# EAGLE schematic variable_supply_module_v2 (EAGLE 6.5.0)
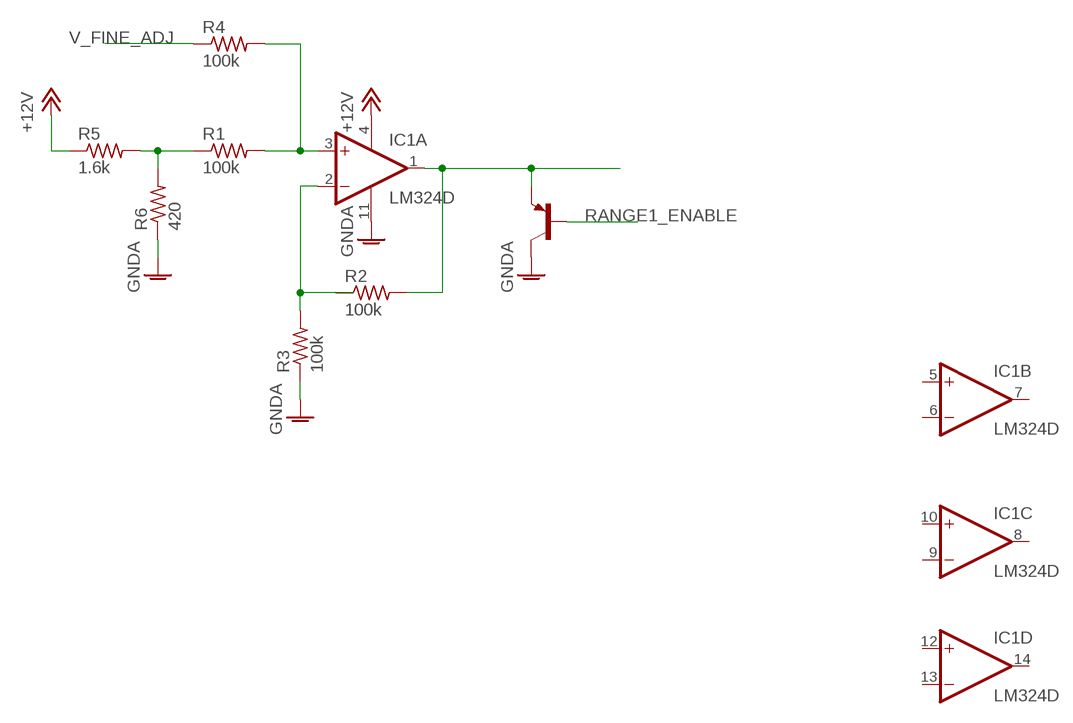
[diagram p0: schematic, sheet 1]

## Parts
IC1  LM324D  [SO14]
R1  100k  R-US_M0805  [M0805]
R2  100k  R-US_M0805  [M0805]
R3  100k  R-US_M0805  [M0805]
R4  100k  R-US_M0805  [M0805]
R5  1.6k  R-US_M0805  [M0805]
R6  420  R-US_M0805  [M0805]
T1  MMBT3906LT1-PNP-SOT23-BEC  [SOT23-BEC]

## Nets
+12V: IC1.4(P:V+) R5.1
GNDA: IC1.11(P:V-) R3.1 R6.1 T1.C
N$1: IC1.1(A:OUT) R2.2 T1.E
N$2: IC1.2(A:-IN) R3.2
N$3: IC1.3(A:+IN) R1.2 R4.2
N$4: R1.1 R5.2 R6.2
RANGE1_ENABLE: T1.B
V_FINE_ADJ: R4.1
Unconnected: IC1.5(B:+IN) IC1.6(B:-IN) IC1.7(B:OUT) IC1.8(C:OUT) IC1.9(C:-IN) IC1.10(C:+IN) IC1.12(D:+IN) IC1.13(D:-IN) IC1.14(D:OUT) R2.1

## Library data of the parts
IC1 = linear:LM324: OP AMP
R1-R6 = resistor:R-US_: RESISTOR, American symbol
T1 = transistor-neu-to92:*-PNP-: PNP Transistror